# EAGLE design SD_Sniffer (EAGLE 6.4)
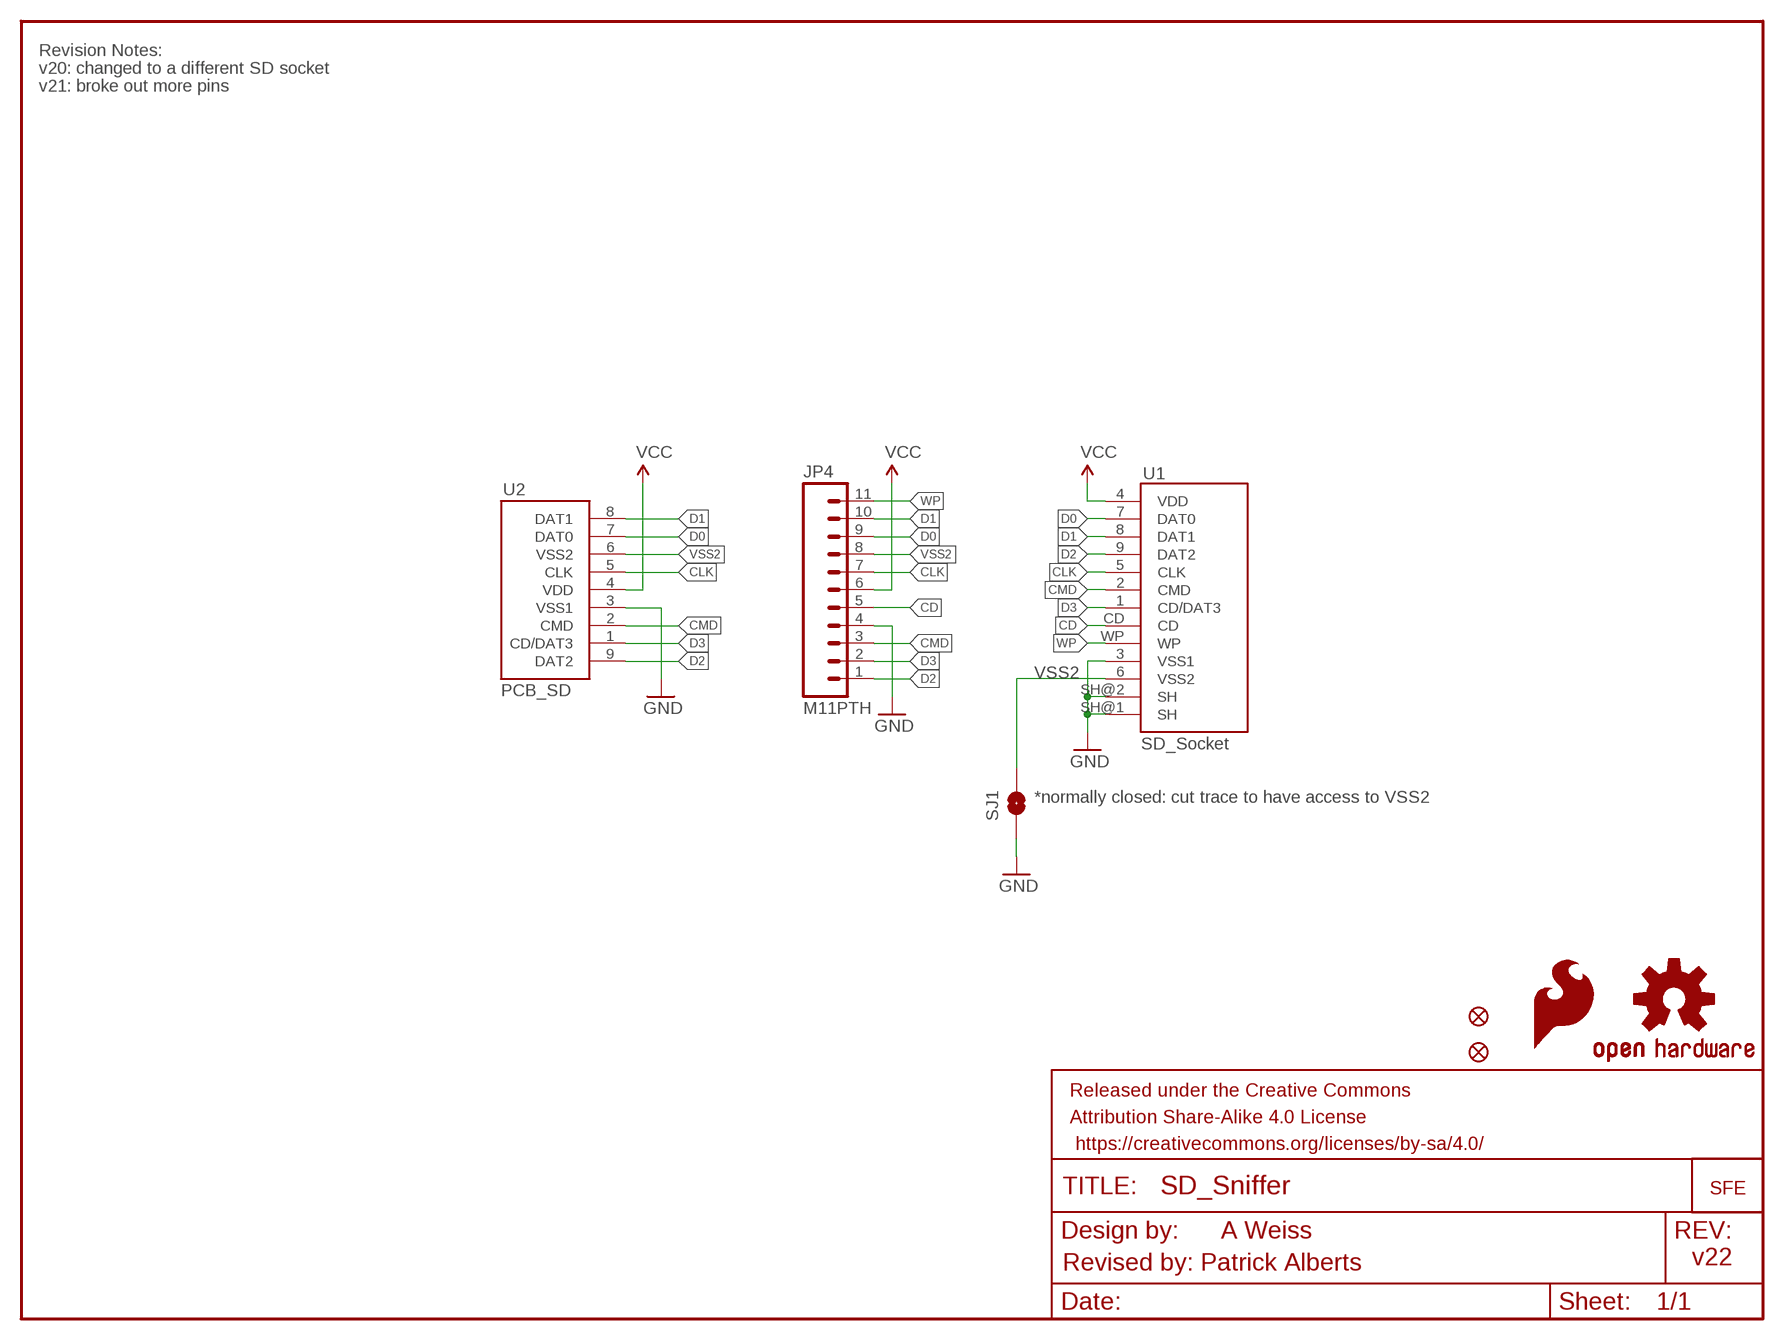
[diagram p0: schematic, sheet 1]

## Parts
FRAME1  FRAME-LETTER  [CREATIVE_COMMONS]
JP2  FIDUCIALUFIDUCIAL  [MICRO-FIDUCIAL]
JP3  FIDUCIALUFIDUCIAL  [MICRO-FIDUCIAL]
JP4  M11PTH  [1X11]
LOGO  LOGO-SFENEW  [SFE-NEW-WEBLOGO]
SJ1  SOLDERJUMPERTRACE  [SJ_2S-TRACE]
U1  SD_CARD_SOCKET  [SD_1:1]
U2  SD_MMC_CARDSD_PCB  [SD-MMC-CARD]
U$2  OSHW-LOGOS  [OSHW-LOGO-S]
U$4  SFE_LOGO_FLAME.2_INCH  [SFE_LOGO_FLAME_.2]

## Nets
CD: JP4.5 U1.CD
CLK: JP4.7 U1.5(CLK) U2.5(CLK)
CMD: JP4.3 U1.2(CMD) U2.2(CMD)
D0: JP4.9 U1.7(DAT0) U2.7(DAT0)
D1: JP4.10 U1.8(DAT1) U2.8(DAT1)
D2: JP4.1 U1.9(DAT2) U2.9(DAT2)
D3: JP4.2 U1.1(CD/DAT3) U2.1(CD/DAT3)
GND: JP4.4 SJ1.1 U1.3(VSS1) U1.SH@1(SH) U1.SH@2(SH) U2.3(VSS1)
VCC: JP4.6 U1.4(VDD) U2.4(VDD)
VSS2: JP4.8 SJ1.2 U1.6(VSS2) U2.6(VSS2)
WP: JP4.11 U1.WP

## Notes on the sheet
- Revision Notes:
- v20: changed to a different SD socket
- v21: broke out more pins
- PCB_SD
- SD_Socket
- *normally closed: cut trace to have access to VSS2
- A Weiss
- Revised by: Patrick Alberts | v22

## Library data of the parts
FRAME1 = SparkFun-Aesthetics:FRAME-LETTER: Schematic Frame Standard 8.5x11 US Letter frame
JP2 JP3 = SparkFun:FIDUCIAL: Fiducial Alignment Points Various fiducial points for machine vision alignment.
JP4 = SparkFun-Connectors:M11: Header 11 Standard 11-pin 0.1" header. Use with straight break away headers (SKU : PRT-00116), right angle break away headers (PRT-00553), swiss pins (PRT-00743), machine pins (PRT-00117), and female headers (PRT-00115).
LOGO = SparkFun:LOGO-SFE: Spark Fun Electronics PCB Logo This is the standard Spark Fun Electronics PCB logo.
SJ1 = SparkFun-Passives:SOLDERJUMPER: Solder Jumper Standard SMD solder jumper. Used to automate production. Two varients : Normally Open and Normally Closed are the same, but have different paste layers. NC will have a large amount of paste and should jumper during reflow.
U1 = SparkFun-Connectors:SD_CARD_SOCKET: SD Memory Card Connector, push-push normal type, CD enable, WP enable
U2 = SparkFun-Boards:SD_MMC_CARD: Mechanical size of an SD/MMC card- NOT a socket!
U$2 = SparkFun-Aesthetics:OSHW-LOGO: Open Source Hardware Logo This logo indicates the piece of hardware it is found on incorporates a OSHW license and/or adheres to the definition of open source hardware found here: http://freedomdefined.org/OSHW
U$4 = SparkFun-Aesthetics:SFE_LOGO_FLAME: SFE Logo, flame only This is the SparkFun flame logo. The logo on the schematic will always be the same size; the package variant is the height of the flame. Default layer for the logo on the board is tSilk.

## Board
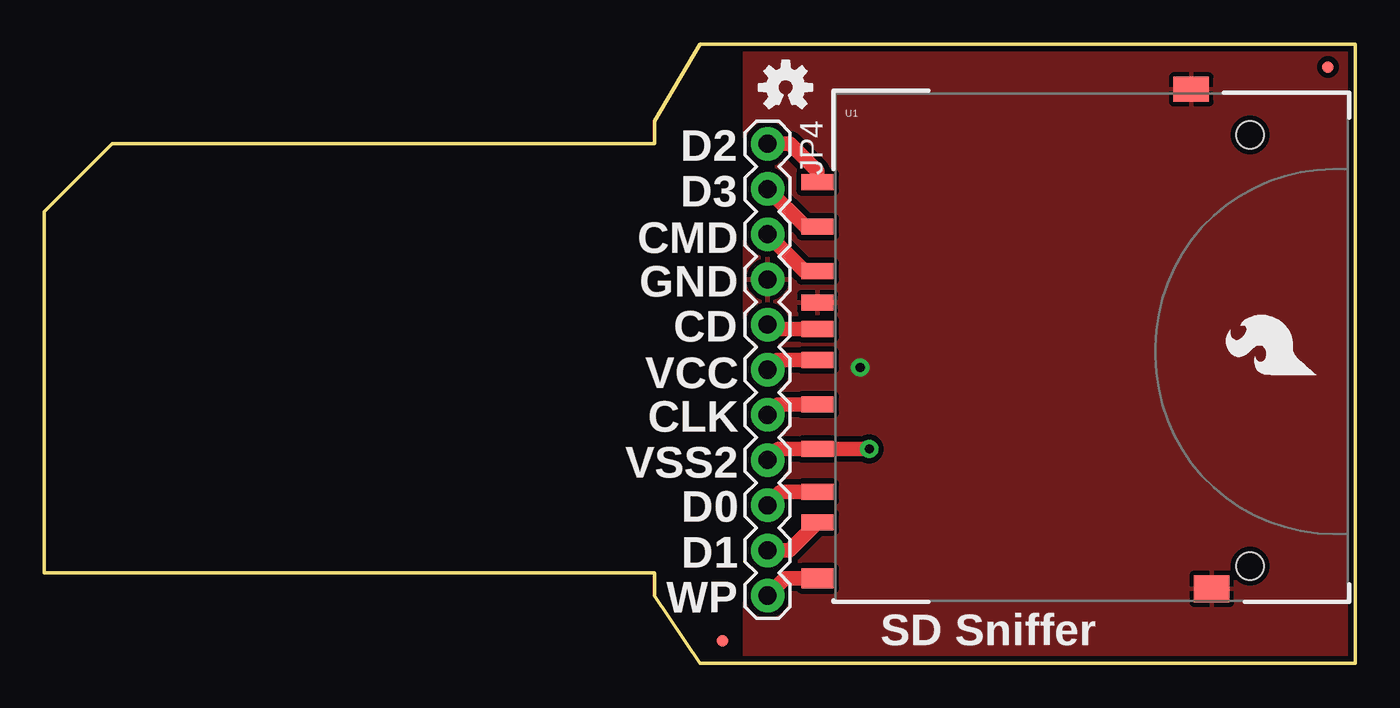
[diagram p1: board, top side]
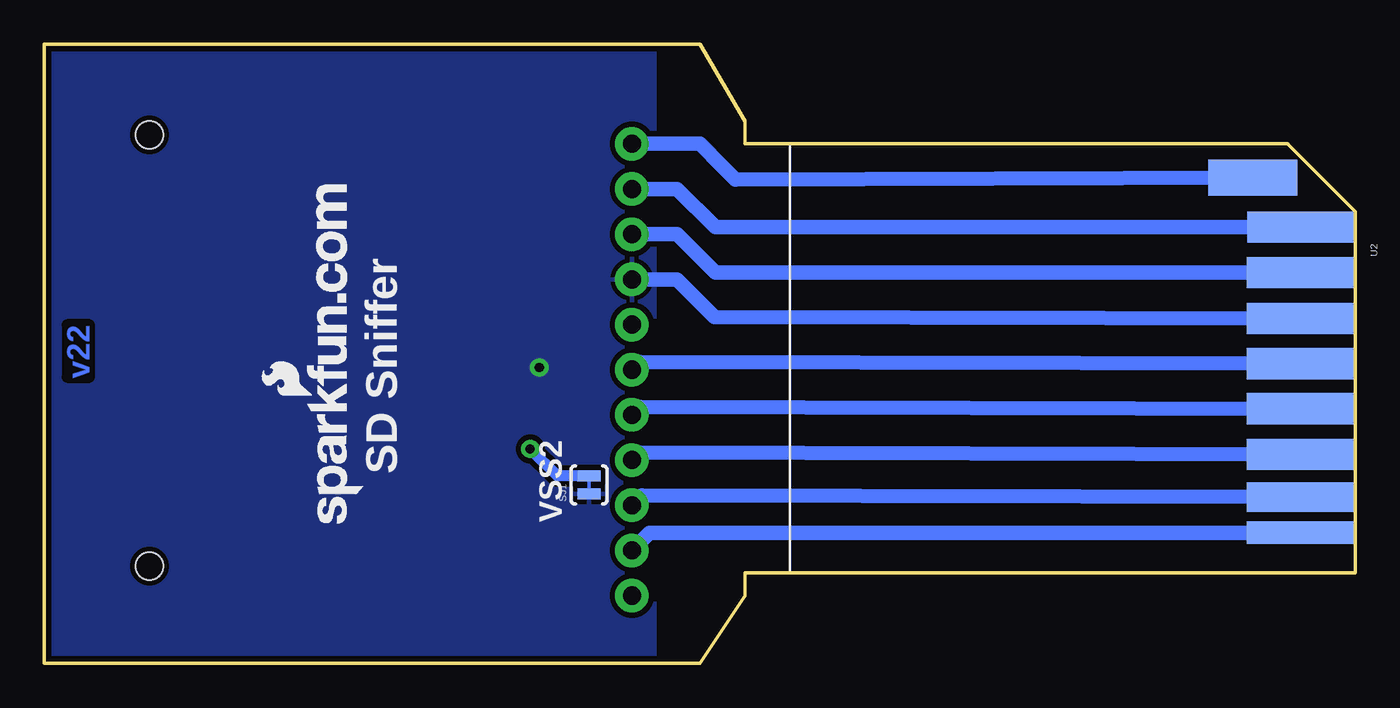
[diagram p2: board, bottom side, seen from below]

Size 73.66 x 34.8 mm. Coordinates in mm from the lower left corner, seen from the top.
Outline: 73.66,0 73.66,34.8 36.83,34.8 34.29,30.48 34.29,29.21 3.81,29.21 0,25.4 0,5.08 34.29,5.08 34.29,3.81 36.83,0 73.66,0
Copper layers (1*16): Top 0.035mm / dielectric 1.5mm / Bottom 0.035mm
Design rules "SparkFun-2-layer": minimum track width 7mil, minimum drill 15mil, track to track 8mil, track to pad 8mil, pad to pad 8mil, via to via 8mil, smd to smd 8mil, copper to edge 8mil, drill to drill 8mil, minimum pad ring 12mil, minimum via ring 10mil, stop-mask expansion 4mil, vias tented up to drill 20mil, thermal gap 10mil

### Footprints (pad centres in the part's own frame; a part is rotated, then mirrored left to right if it is on the bottom)
MICRO-FIDUCIAL = smd 0.635 x 0.635: 1 0,0
1X11 = drill 1.016 pad 1.88: 1 0,0; 2 2.54,0; 3 5.08,0; 4 7.62,0; 5 10.16,0; 6 12.7,0; 7 15.24,0; 8 17.78,0; 9 20.32,0; 10 22.86,0; 11 25.4,0
SJ_2S-TRACE = smd 0.635 x 1.27: 1 -0.508,0; 2 0.508,0
SD_1:1 = smd 1.8 x 0.9: 1 -1,6.77; 2 -1,4.27; 3 -1,2.52; 4 -1,-0.73; 5 -1,-3.23; 6 -1,-5.73; 7 -1,-8.15; 8 -1,-9.85; 9 -1,9.27; CD -1,1.02 | smd 2 x 1.4: SH@1 20,14.496 | smd 2 x 1.527: SH@2 21.15,-13.589 | smd 1.8 x 1.1: WP -1,-13 | hole 1.55: 23.3,11.94; 23.3,-12.32
SD-MMC-CARD = smd 1.75 x 6: 1 -6.745,14.713; 2 -4.195,14.703; 3 -1.6,14.703; 4 0.93,14.703; 5 3.465,14.703; 6 6.03,14.703 | smd 1.65 x 6: 7 8.43,14.703 | smd 1.25 x 6: 8 10.43,14.703 | smd 2 x 5: 9 -9.53,12.03

### Placement (x,y rotation side)
FRAME1  19.66,-19.05 0 top  (outside the outline)
JP2  72.14,33.53 0 top
JP3  38.1,1.27 0 top
JP4  40.64,29.21 270 top
LOGO  55.75,7.87 90 bottom
SJ1  43.05,10.03 90 bottom
U1  44.45,17.78 0 top
U2  17.78,17.78 270 bottom
U$2  41.66,32.38 0 top
U$4  71.75,15.88 90 top

### Tracks (layer width: path | path; a pad name or v marks a point on that pad's centre or on a via)
CD
  Top 0.813: U1.CD 40.89,18.8 JP4.5
CLK
  Top 0.813: U1.5 41.22,14.55 JP4.7
  Bottom 0.813: U2.5 40.2,14.41 JP4.7
CMD
  Top 0.813: U1.2 42.72,22.05 JP4.3
  Bottom 0.813: U2.2 35.95,21.97 38.1,24.13 JP4.3
D0
  Top 0.813: U1.7 41.38,9.63 JP4.9
  Bottom 0.813: U2.7 40.08,9.45 JP4.9
D1
  Top 0.813: JP4.10 41.87,6.35 U1.8
  Bottom 0.813: U2.8 39.64,7.35 JP4.10
D2
  Top 0.813: JP4.1 41.91,29.21 43.18,27.94 43.45,27.67 U1.9
  Bottom 0.813: JP4.1 36.83,29.21 35.56,27.94 34.83,27.21 U2.9
D3
  Top 0.813: U1.1 42.76,24.55 JP4.2
  Bottom 0.813: U2.1 35.95,24.52 38.1,26.67 JP4.2
GND  (via drill 0.51)
  Bottom 0.813: U2.3 35.99,19.48 38.1,21.59 JP4.4
  other vias: 45.85,16.64
  pour Top (isolate 0.305): 39.37,34.8 39.37,0 73.66,0 73.66,34.8
  pour Bottom (isolate 0.305): 39.37,34.8 39.37,0 73.66,0 73.66,34.8
VCC
  Top 0.813: U1.4 41.18,17.05 JP4.6
  Bottom 0.813: U2.4 40.2,16.95 JP4.6
VSS2  (via drill 0.51)
  Top 0.813: JP4.8 41.26,12.05 U1.6 v46.34,12.05 v46.35,12.06
  Bottom 0.61: SJ1.2 44.83,10.54 v46.35,12.06
  Bottom 0.813: U2.6 40.22,11.85 JP4.8
WP
  Top 0.813: U1.WP 41.61,4.78 JP4.11

### Text on the board
Bottom: v22
tPlace: D2 | D3 | CMD | GND | CD | VCC | CLK | VSS2 | D0 | D1 | WP | SD Sniffer
bPlace: VSS2 | SD Sniffer
tDocu: Aaron Weiss | Revised by: Patrick Alberts